# EAGLE design STM_Proto1 (EAGLE 6.1)
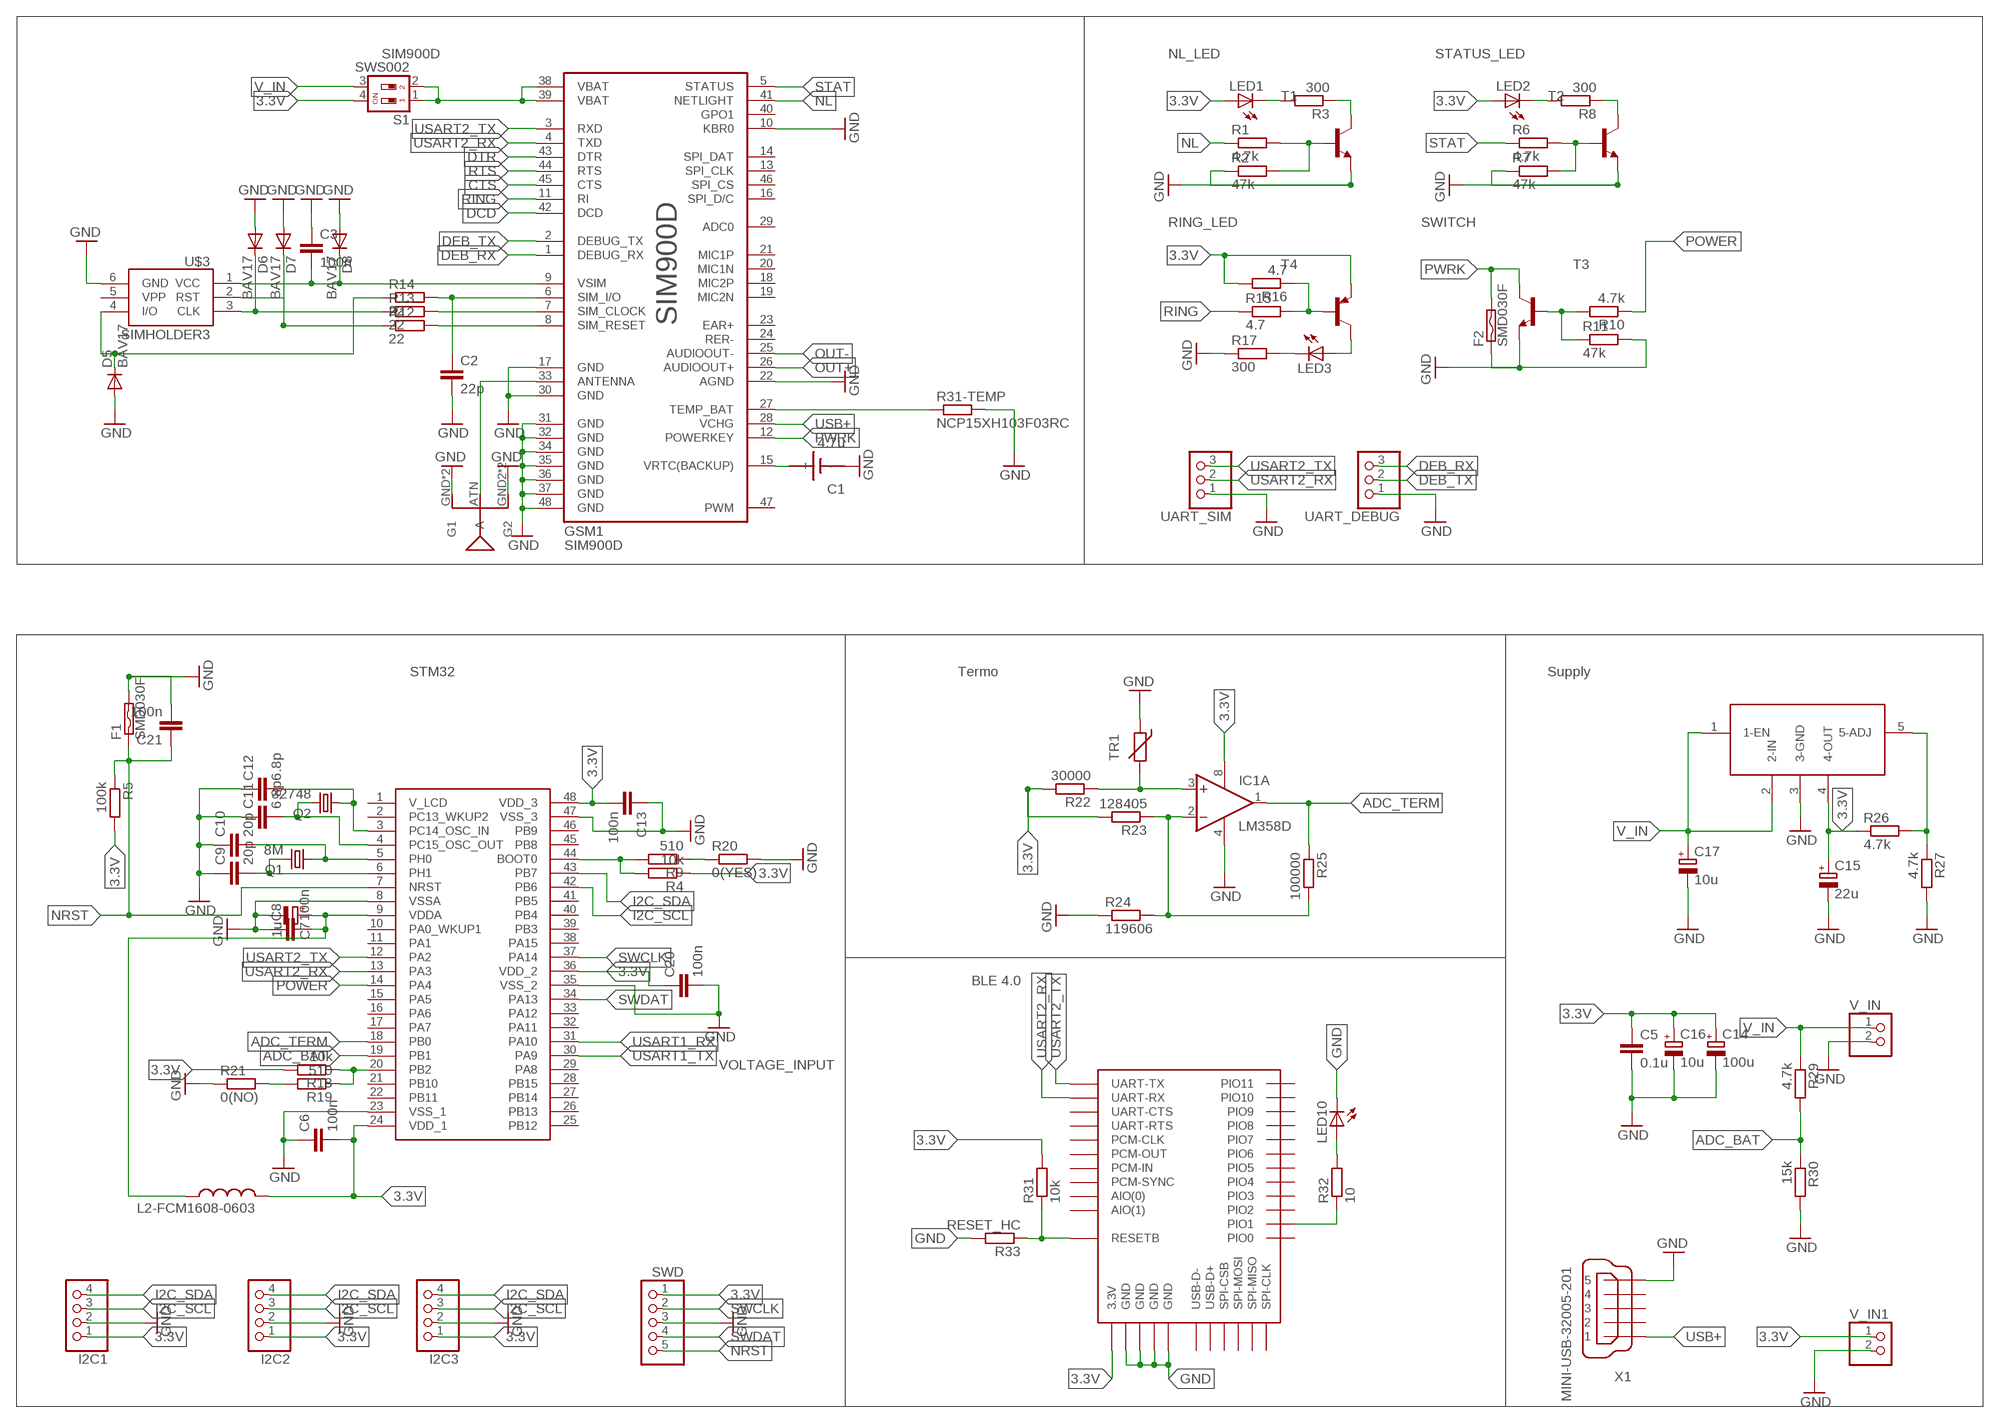
[diagram p0: schematic, sheet 1]

## Parts
C1  4.7u  SN2032  [SN2032]
C2  22p  C-EUC1206  [C1206]
C3  100n  C-EUC0805  [C0805]
C5  0.1u  C-EUC0805  [C0805]
C6  100n  C-EUC0805  [C0805]
C7  1u  CPOL-EU153CLV-0405  [153CLV-0405]
C8  100n  C-EUC0805  [C0805]
C9  20p  C-EUC0805  [C0805]
C10  20p  C-EUC0805  [C0805]
C11  6.8p  C-EUC0805  [C0805]
C12  6.8p  C-EUC0805  [C0805]
C13  100n  C-EUC0805  [C0805]
C14  100u  CPOL-EU153CLV-0807  [153CLV-0807]
C15  22u  CPOL-EU153CLV-0605  [153CLV-0605]
C16  10u  CPOL-EU153CLV-0505  [153CLV-0505]
C17  10u  CPOL-EU153CLV-0505  [153CLV-0505]
C20  100n  C-EUC0805  [C0805]
C21  100n  C-EUC0805  [C0805]
D5  BAV17  [DO35-10]
D6  BAV17  [DO35-10]
D7  BAV17  [DO35-10]
D8  BAV17  [DO35-10]
F1  SMD030F  [SMD050F]
F2  SMD030F  [SMD050F]
GSM1  SIM900D  [SIM900D]
I2C1  PINHD-1X4  [1X04]
I2C2  PINHD-1X4  [1X04]
I2C3  PINHD-1X4  [1X04]
IC1  LM358D  [SO08]
L2-FCM1608-0603  L-USL3216C  [L3216C]
LED1  LEDSMT1206  [1206]
LED2  LEDSMT1206  [1206]
LED3  LEDSMT1206  [1206]
LED10  LEDCHIPLED_1206  [CHIPLED_1206]
Q1  8M  CRYSTALHC49S  [HC49/S]
Q2  32748  CRYSTALTC26H  [TC26H]
R1  4.7k  R-EU_R0805  [R0805]
R2  47k  R-EU_R0805  [R0805]
R3  300  R-EU_R0805  [R0805]
R4  10k  R-EU_R0805  [R0805]
R5  100k  R-EU_R0805  [R0805]
R6  4.7k  R-EU_R0805  [R0805]
R7  47k  R-EU_R0805  [R0805]
R8  300  R-EU_R0805  [R0805]
R9  510  R-EU_R0805  [R0805]
R10  4.7k  R-EU_R0805  [R0805]
R11  47k  R-EU_R0805  [R0805]
R12  22  R-EU_R0805  [R0805]
R13  22  R-EU_R0805  [R0805]
R14  22  R-EU_R0805  [R0805]
R15  4.7  R-EU_R0805  [R0805]
R16  4.7  R-EU_R0805  [R0805]
R17  300  R-EU_R0805  [R0805]
R18  10k  R-EU_M0805  [M0805]
R19  510  R-EU_R0805  [R0805]
R20  0(YES)  R-EU_R1206  [R1206]
R21  0(NO)  R-EU_R1206  [R1206]
R22  30000  R-EU_R0805  [R0805]
R23  128405  R-EU_R0805  [R0805]
R24  119606  R-EU_R0805  [R0805]
R25  100000  R-EU_R0805  [R0805]
R26  4.7k  R-EU_R0805  [R0805]
R27  4.7k  R-EU_R0805  [R0805]
R29  4.7k  R-EU_R0805  [R0805]
R30  15k  R-EU_R0805  [R0805]
R31  10k  R-EU_M0805  [M0805]
R31-TEMP  NCP15XH103F03RC  R-EU_M0805  [M0805]
R32  10  R-EU_M0805  [M0805]
R33  RESET_HC  R-EU_M0805  [M0805]
S1  SWS002  [SMS-002]
STM32L152CBT6  STM32L152C6  [LQFP48]
SWD  PINHD-1X5  [1X05]
T1  BC846B-NPN-SOT23-BEC  [SOT23-BEC]
T2  BC846B-NPN-SOT23-BEC  [SOT23-BEC]
T3  BC846B-NPN-SOT23-BEC  [SOT23-BEC]
T4  BC858CLT1-PNP-SOT23-BEC  [SOT23-BEC]
TR1  THERMISTOR_R-7,5  [R-7,5]
U$2  GSM_ANT  [GSM]
U$3  SIMHOLDER3  [SIMHOLDER3]
U$4  BTM400_6B  [BTM400_6B]
U$5  MIC29302WT  [TO263-5]
UART_DEBUG  PINHD-1X3  [1X03]
UART_SIM  PINHD-1X3  [1X03]
V_IN  PINHD-1X2  [1X02]
V_IN1  PINHD-1X2  [1X02]
X1  MINI-USB-32005-201  [32005-201]

## Nets
3.3V: C5.1 C6.2 C13.2 C14.+ C15.+ C16.+ C20.1 I2C1.1 I2C2.1 I2C3.1 IC1.8(P:V+) L2-FCM1608-0603.2 LED1.A LED2.A R4.1 R5.2 R16.2 R18.2 R22.2 R23.2 R26.1 R31.2 S1.4 STM32L152CBT6.24(VDD_1) STM32L152CBT6.36(VDD_2) STM32L152CBT6.48(VDD_3) SWD.1 T4.E U$4.3.3V U$5.4(4-OUT) V_IN1.1
ADC_BAT: R29.2 R30.1 STM32L152CBT6.19(PB1)
ADC_TERM: IC1.1(A:OUT) R25.1 STM32L152CBT6.18(PB0)
CTS: GSM1.45(CTS)
DCD: GSM1.42(DCD)
DEB_RX: GSM1.1(DEBUG_RX) UART_DEBUG.3
DEB_TX: GSM1.2(DEBUG_TX) UART_DEBUG.2
DTR: GSM1.43(DTR)
GND: C1.- C2.2 C3.1 C5.2 C6.1 C7.- C8.1 C9.1 C10.1 C11.1 C12.1 C13.1 C14.- C15.- C16.- C17.- C20.2 C21.2 D5.A D6.A D7.A D8.A F1.2 F2.1 GSM1.10(KBR0) GSM1.17(GND) GSM1.22(AGND) GSM1.30(GND) GSM1.31(GND) GSM1.32(GND) GSM1.34(GND) GSM1.35(GND) GSM1.36(GND) GSM1.37(GND) GSM1.48(GND) I2C1.2 I2C2.2 I2C3.2 IC1.4(P:V-) LED10.C R2.1 R7.1 R11.2 R17.1 R20.2 R21.1 R24.1 R27.2 R30.2 R31-TEMP.2 R33.2 STM32L152CBT6.8(VSSA) STM32L152CBT6.23(VSS_1) STM32L152CBT6.35(VSS_2) STM32L152CBT6.47(VSS_3) SWD.3 T1.E T2.E T3.E TR1.1 U$2.GND1(G1) U$2.GND2(G2) U$2.GND3(G2) U$2.GND(G1) U$3.6(GND) U$4.GND@1(GND) U$4.GND@2(GND) U$4.GND@3(GND) U$4.GND@4(GND) U$5.3(3-GND) UART_DEBUG.1 UART_SIM.1 V_IN1.2 V_IN.2 X1.5
I2C_SCL: I2C1.3 I2C2.3 I2C3.3 STM32L152CBT6.42(PB6)
I2C_SDA: I2C1.4 I2C2.4 I2C3.4 STM32L152CBT6.43(PB7)
N$1: R10.2 R11.1 T3.B
N$2: C10.2 Q1.1 STM32L152CBT6.5(PH0)
N$3: LED1.C R3.2
N$4: R1.2 R2.2 T1.B
N$5: R3.1 T1.C
N$6: R31.1 R33.1 U$4.RESETB
N$8: R6.2 R7.2 T2.B
N$9: R8.1 T2.C
N$10: C3.2 D8.C GSM1.9(VSIM) U$3.1(VCC)
N$11: LED2.C R8.2
N$12: IC1.2(A:-IN) R23.1 R24.2 R25.2
N$13: IC1.3(A:+IN) R22.1 TR1.2
N$14: D7.C R12.1 U$3.2(RST)
N$15: GSM1.8(SIM_RESET) R12.2
N$16: D6.C R13.1 U$3.3(CLK)
N$17: GSM1.7(SIM_CLOCK) R13.2
N$18: D5.C R14.1 U$3.4(I/O)
N$19: C2.1 GSM1.6(SIM_I/O) R14.2
N$20: GSM1.27(TEMP_BAT) R31-TEMP.1
N$21: R32.1 U$4.PIO(1)(PIO1)
N$22: R15.2 R16.1 T4.B
N$23: GSM1.33(ANTENNA) U$2.ATN(A)
N$24: LED3.A T4.C
N$25: LED3.C R17.2
N$28: C9.2 Q1.2 STM32L152CBT6.6(PH1)
N$29: C11.2 Q2.2 STM32L152CBT6.4(PC15_OSC_OUT)
N$30: C12.2 Q2.1 STM32L152CBT6.3(PC14_OSC_IN)
N$31: C7.+ C8.2 L2-FCM1608-0603.1 STM32L152CBT6.9(VDDA)
N$32: R4.2 R9.2 STM32L152CBT6.44(BOOT0)
N$33: LED10.A R32.2
N$34: R9.1 R20.1
N$35: R18.1 R19.1 STM32L152CBT6.20(PB2)
N$36: R19.2 R21.2
N$38: R26.2 R27.1 U$5.5(5-ADJ)
NL: GSM1.41(NETLIGHT) R1.1
NRST: C21.1 F1.1 R5.1 STM32L152CBT6.7(NRST) SWD.5
OUT+: GSM1.26(AUDIOOUT+)
OUT-: GSM1.25(AUDIOOUT-)
POWER: R10.1 STM32L152CBT6.14(PA4)
PWRK: F2.2 GSM1.12(POWERKEY) T3.C
RING: GSM1.11(RI) R15.1
RTS: GSM1.44(RTS)
STAT: GSM1.5(STATUS) R6.1
SWCLK: STM32L152CBT6.37(PA14) SWD.2
SWDAT: STM32L152CBT6.34(PA13) SWD.4
USART1_RX: STM32L152CBT6.31(PA10)
USART1_TX: STM32L152CBT6.30(PA9)
USART2_RX: GSM1.4(TXD) STM32L152CBT6.13(PA3) U$4.UART-RX UART_SIM.2
USART2_TX: GSM1.3(RXD) STM32L152CBT6.12(PA2) U$4.UART-TX UART_SIM.3
USB+: GSM1.28(VCHG) X1.1
V_IN: C17.+ R29.1 S1.3 U$5.1(1-EN) U$5.2(2-IN) V_IN.1
VBAT@2: GSM1.38(VBAT) GSM1.39(VBAT) S1.1 S1.2
VRTC(BACKUP): C1.+ GSM1.15(VRTC(BACKUP))
Unconnected: GSM1.13(SPI_CLK) GSM1.14(SPI_DAT) GSM1.16(SPI_D/C) GSM1.18(MIC2P) GSM1.19(MIC2N) GSM1.20(MIC1N) GSM1.21(MIC1P) GSM1.23(EAR+) GSM1.24(RER-) GSM1.29(ADC0) GSM1.40(GPO1) GSM1.46(SPI_CS) GSM1.47(PWM) IC1.5(B:+IN) IC1.6(B:-IN) IC1.7(B:OUT) STM32L152CBT6.1(V_LCD) STM32L152CBT6.2(PC13_WKUP2) STM32L152CBT6.10(PA0_WKUP1) STM32L152CBT6.11(PA1) STM32L152CBT6.15(PA5) STM32L152CBT6.16(PA6) STM32L152CBT6.17(PA7) STM32L152CBT6.21(PB10) STM32L152CBT6.22(PB11) STM32L152CBT6.25(PB12) STM32L152CBT6.26(PB13) STM32L152CBT6.27(PB14) STM32L152CBT6.28(PB15) STM32L152CBT6.29(PA8) STM32L152CBT6.32(PA11) STM32L152CBT6.33(PA12) STM32L152CBT6.38(PA15) STM32L152CBT6.39(PB3) STM32L152CBT6.40(PB4) STM32L152CBT6.41(PB5) STM32L152CBT6.45(PB8) STM32L152CBT6.46(PB9) U$3.5(VPP) U$4.AIO(0) U$4.AIO(1) U$4.PCM-CLK U$4.PCM-IN U$4.PCM-OUT U$4.PCM-SYNC U$4.PIO(0)(PIO0) U$4.PIO(2)(PIO2) U$4.PIO(3)(PIO3) U$4.PIO(4)(PIO4) U$4.PIO(5)(PIO5) U$4.PIO(6)(PIO6) U$4.PIO(7)(PIO7) U$4.PIO(8)(PIO8) U$4.PIO(9)(PIO9) U$4.PIO(10)(PIO10) U$4.PIO(11)(PIO11) U$4.SPI-CLK U$4.SPI-CSB U$4.SPI-MISO U$4.SPI-MOSI U$4.UART-CTS U$4.UART-RTS U$4.USB-D+ U$4.USB-D- X1.2 X1.3 X1.4

## Notes on the sheet
- SIM900D | NL_LED | STATUS_LED
- RING_LED | SWITCH
- STM32 | Termo | Supply
- BLE 4.0
- VOLTAGE_INPUT

## Library data of the parts
C1 = sn2032:SN2032: LI BATTERY
C2 C3 C5 C6 C8-C13 C20 C21 = resistor:C-EU: CAPACITOR, European symbol
C7 C14-C17 = resistor:CPOL-EU: POLARIZED CAPACITOR, European symbol
D5-D8 = diode:BAV17: DIODE silicon-epitaxial planar diode
F1 F2 = switch-raychem:SMD*F: PolySwitch (TM) Resettable Device Source: Data sheet <http://www.farnell.com/datasheets/13482.pdf>
GSM1 = SIM900D:SIM900D: maciek@chwarzno.pl Maciej Kalinowski SIM900D MARITEX: SIM900D http://wm.sim.com/upfile/201264161119f.pdf
I2C1-I2C3 = pinhead:PINHD-1X4: PIN HEADER
IC1 = linear:LM358: OP AMP also LM158; LM258; LM2904 Source: http://cache.national.com/ds/LM/LM158.pdf
L2-FCM1608-0603 = resistor:L-US: INDUCTOR, American symbol
LED1-LED3 LED10 = led:LED: LED OSRAM: - CHIPLED LG R971, LG N971, LY N971, LG Q971, LY Q971, LO R971, LY R971 LH N974, LH R974 LS Q976, LO Q976, LY Q976 LO Q996 - Hyper CHIPLED LW Q18S LB Q993, LB Q99A, LB R99A - SideLED LS A670, LO A670, LY A670, LG A670, LP A670 LB A673, LV A673, LT A673, LW A673 LH A674 LY A675 LS A676, LA A676, LO A676, LY A676, LW A676 LS A679, LY A679, LG A679 - Hyper Micro SIDELED® LS Y876, LA Y876, LO Y876, LY Y876 LT Y87S - SmartLED LW L88C, LW L88S LB L89C, LB L89S, LG L890 LS L89K, LO L89K, LY L89K LS L896, LA L896, LO L896, LY L896 - TOPLED LS T670, LO T670, LY T670, LG T670, LP T670 LSG T670, LSP T670, LSY T670, LOP T670, LYG T670 LG T671, LOG T671, LSG T671 LB T673, LV T673, LT T673, LW T673 LH T674 LS T676, LA T676, LO T676, LY T676, LB T676, LH T676, LSB T676, LW T676 LB T67C, LV T67C, LT T67C, LS T67K, LO T67K, LY T67K, LW E67C LS E67B, LA E67B, LO E67B, LY E67B, LB E67C, LV E67C, LT E67C LW T67C LS T679, LY T679, LG T679 LS T770, LO T770, LY T770, LG T770, LP T770 LB T773, LV T773, LT T773, LW T773 LH T774 LS E675, LA E675, LY E675, LS T675 LS T776, LA T776, LO T776, LY T776, LB T776 LHGB T686 LT T68C, LB T68C - Hyper Mini TOPLED® LB M676 - Mini TOPLED Santana® LG M470 LS M47K, LO M47K, LY M47K Source: http://www.osram.convergy.de LUXEON: - LUMILED® LXK2-PW12-R00, LXK2-PW12-S00, LXK2-PW14-U00, LXK2-PW14-V00 LXK2-PM12-R00, LXK2-PM12-S00, LXK2-PM14-U00 LXK2-PE12-Q00, LXK2-PE12-R00, LXK2-PE12-S00, LXK2-PE14-T00, LXK2-PE14-U00 LXK2-PB12-K00, LXK2-PB12-L00, LXK2-PB12-M00, LXK2-PB14-N00, LXK2-PB14-P00, LXK2-PB14-Q00 LXK2-PR12-L00, LXK2-PR12-M00, LXK2-PR14-Q00, LXK2-PR14-R00 LXK2-PD12-Q00, LXK2-PD12-R00, LXK2-PD12-S00 LXK2-PH12-R00, LXK2-PH12-S00 LXK2-PL12-P00, LXK2-PL12-Q00, LXK2-PL12-R00 Source: www.luxeon.com KINGBRIGHT: KA-3528ASYC Source: www.kingbright.com
Q1 = crystal:CRYSTAL: CRYSTAL; OC_FARNELL: 1667008; OC_NEWARK: unknown
Q2 = crystal:CRYSTAL: CRYSTAL; OC_FARNELL: unknown; OC_NEWARK: unknown
R1-R27 R29-R31 R31-TEMP R32 R33 = resistor:R-EU_: RESISTOR, European symbol
S1 = smd-special:SWS002: SMD Dip Switch 2 pol.
STM32L152CBT6 = STM32L152:STM32L152C6
SWD = pinhead:PINHD-1X5: PIN HEADER
T1-T3 = transistor:*-NPN-: NPN Transistror BF959 corrected 2008.03.06
T4 = transistor:*-PNP-: PNP Transistror
TR1 = discrete:THERMISTOR_: Thermo Resistor
U$2 = discrete:GSM_ANT
U$3 = SparkFun-Connectors:SIMHOLDER3: Alternate SIM card socket
U$4 = hc-05 eagle lib:BTM400_6B
U$5 = MIC29302WT:MIC29302WT
UART_DEBUG UART_SIM = pinhead:PINHD-1X3: PIN HEADER
V_IN V_IN1 = pinhead:PINHD-1X2: PIN HEADER
X1 = con-cypressindustries:MINI-USB-: MINI USB-B Conector Source: www.cypressindustries.com; OC_FARNELL: unknown; OC_NEWARK: unknown

## Board
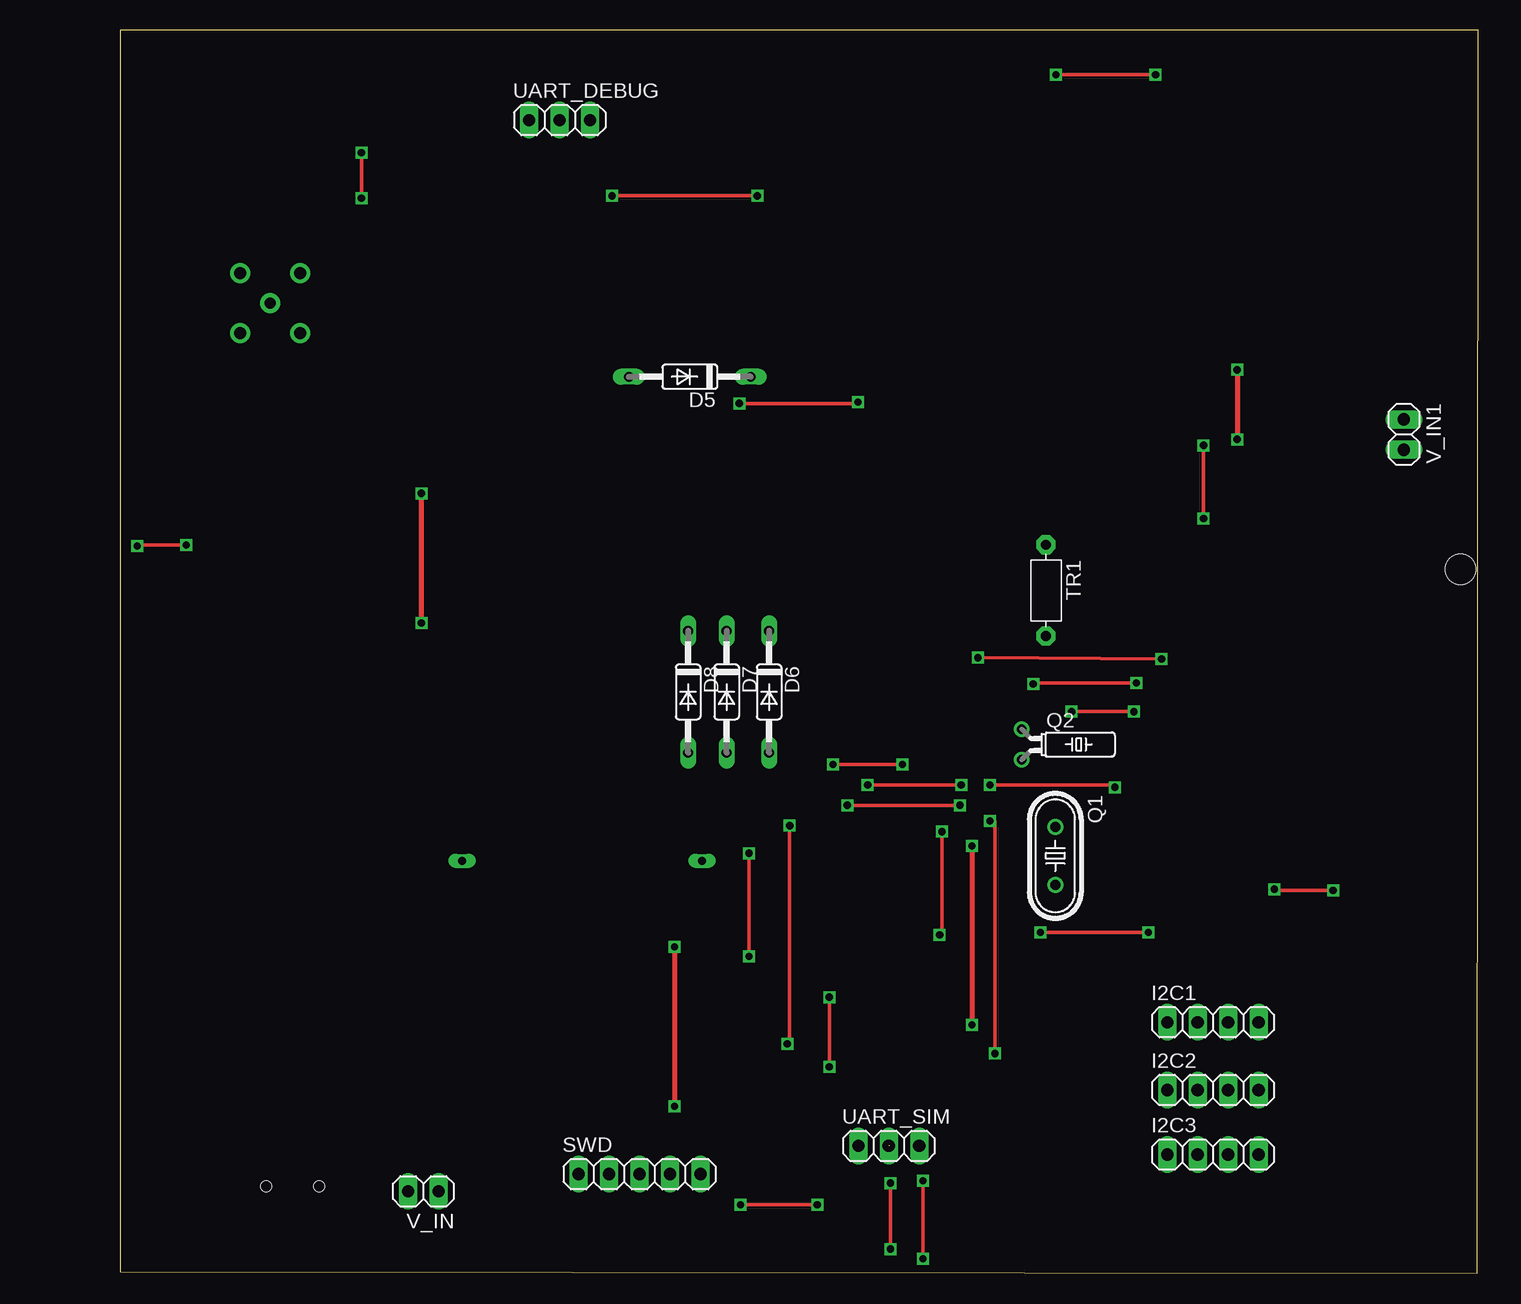
[diagram p1: board, top side]
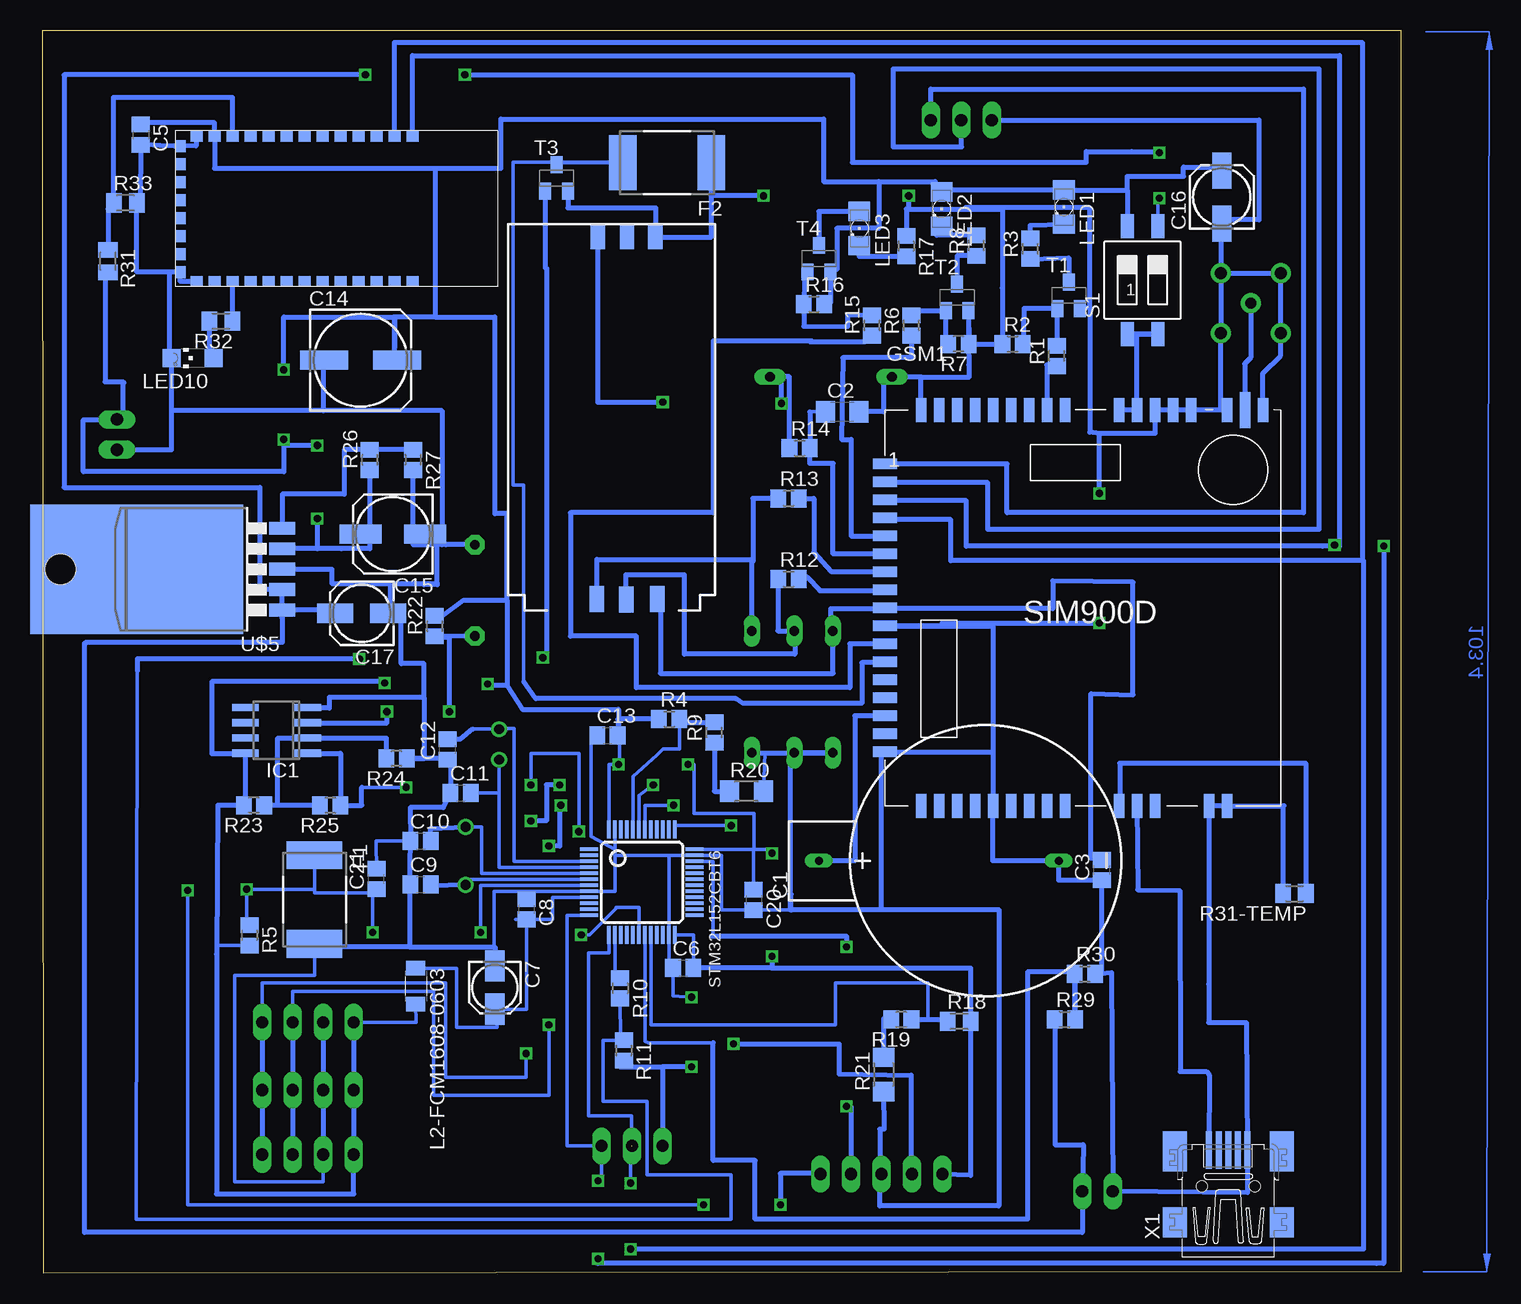
[diagram p2: board, bottom side, seen from below]

Size 113.2 x 103.6 mm. Coordinates in mm from the lower left corner, seen from the top.
Outline: 0,0.1 113.1,0 113.2,103.6 0,103.6 0,0.1
Copper layers (1*16): Top 0.035mm / dielectric 1.5mm / Bottom 0.035mm
Design rules: minimum track width 10mil, minimum drill 24mil, track to track 8mil, track to pad 8mil, pad to pad 8mil, via to via 8mil, smd to smd 8mil, copper to edge 40mil, drill to drill 8mil, minimum pad ring 10mil, minimum via ring 8mil, stop-mask expansion 4mil, vias tented up to drill 0mil, thermal gap 10mil

### Footprints (pad centres in the part's own frame; a part is rotated, then mirrored left to right if it is on the bottom)
SN2032 = drill 0.65 long: + 0,13.9; - 0,-6.1
C1206 = smd 1.6 x 1.8: 1 -1.4,0; 2 1.4,0
C0805 = smd 1.3 x 1.5: 1 -0.85,0; 2 0.85,0
153CLV-0405 = smd 2.6 x 1.6: + 1.8,0; - -1.8,0
153CLV-0807 = smd 4 x 1.6: + 3.05,0; - -3.05,0
153CLV-0605 = smd 3.5 x 1.6: + 2.7,0; - -2.7,0
153CLV-0505 = smd 3 x 1.6: + 2.2,0; - -2.2,0
DO35-10 = drill 0.813 long: A 5.08,0; C -5.08,0
SMD050F = smd 2.3 x 4.6: 1 -3.7,0; 2 3.7,0
SIM900D = smd 2 x 0.9: 1 0,28.5; 2 0,27; 3 0,25.5; 4 0,24; 5 0,22.5; 6 0,21; 7 0,19.5; 8 0,18; 9 0,16.5; 10 0,15; 11 0,13.5; 12 0,12; 13 0,10.5; 14 0,9; 15 0,7.5; 16 0,6; 17 0,4.5 | smd 0.9 x 2: 18 3,0; 19 4.5,0; 20 6,0; 21 7.5,0; 22 9,0; 23 10.5,0; 24 12,0; 25 13.5,0; 26 15,0; 27 19.5,0; 28 21,0; 29 22.5,0; 30 27,0; 31 28.5,0; 32 31.5,33; 34 28.5,33; 35 25.5,33; 36 24,33; 37 22.5,33; 38 21,33; 39 19.5,33; 40 15,33; 41 13.5,33; 42 12,33; 43 10.5,33; 44 9,33; 45 7.5,33; 46 6,33; 47 4.5,33; 48 3,33 | smd 0.9 x 3: 33 30,33
1X04 = drill 1.016 long: 1 -3.81,0; 2 -1.27,0; 3 1.27,0; 4 3.81,0
SO08 = smd 0.6 x 2.2: 1 -1.905,-2.6; 2 -0.635,-2.6; 3 0.635,-2.6; 4 1.905,-2.6; 5 1.905,2.6; 6 0.635,2.6; 7 -0.635,2.6; 8 -1.905,2.6
L3216C = smd 1.2 x 1.6: 1 -1.5,0; 2 1.5,0
1206 = smd 1.6 x 1.803: A -1.422,0; C 1.422,0
CHIPLED_1206 = smd 1.5 x 1.5: A 0,-1.75; C 0,1.75
HC49/S = drill 0.813: 1 -2.413,0; 2 2.413,0
TC26H = drill 0.813: 1 -1.27,0; 2 1.27,0
R0805 = smd 1.3 x 1.5: 1 -0.85,0; 2 0.85,0
M0805 = smd 1.3 x 1.6: 1 -0.95,0; 2 0.95,0
R1206 = smd 1.6 x 1.803: 1 -1.422,0; 2 1.422,0
SMS-002 = smd 1.092 x 2.007: 1 -1.27,-4.496; 2 1.27,-4.496; 3 1.27,4.496; 4 -1.27,4.496
LQFP48 = smd 0.3 x 1.5: 1 -2.75,-4.4; 2 -2.25,-4.4; 3 -1.75,-4.4; 4 -1.25,-4.4; 5 -0.75,-4.4; 6 -0.25,-4.4; 7 0.25,-4.4; 8 0.75,-4.4; 9 1.25,-4.4; 10 1.75,-4.4; 11 2.25,-4.4; 12 2.75,-4.4; 25 2.75,4.4; 26 2.25,4.4; 27 1.75,4.4; 28 1.25,4.4; 29 0.75,4.4; 30 0.25,4.4; 31 -0.25,4.4; 32 -0.75,4.4; 33 -1.25,4.4; 34 -1.75,4.4; 35 -2.25,4.4; 36 -2.75,4.4 | smd 1.5 x 0.3: 13 4.4,-2.75; 14 4.4,-2.25; 15 4.4,-1.75; 16 4.4,-1.25; 17 4.4,-0.75; 18 4.4,-0.25; 19 4.4,0.25; 20 4.4,0.75; 21 4.4,1.25; 22 4.4,1.75; 23 4.4,2.25; 24 4.4,2.75; 37 -4.4,2.75; 38 -4.4,2.25; 39 -4.4,1.75; 40 -4.4,1.25; 41 -4.4,0.75; 42 -4.4,0.25; 43 -4.4,-0.25; 44 -4.4,-0.75; 45 -4.4,-1.25; 46 -4.4,-1.75; 47 -4.4,-2.25; 48 -4.4,-2.75
1X05 = drill 1.016 long: 1 -5.08,0; 2 -2.54,0; 3 0,0; 4 2.54,0; 5 5.08,0
SOT23-BEC = smd 1 x 1.4: B -0.95,-1.1; C 0,1.1; E 0.95,-1.1
R-7,5 = drill 0.813 pad 1.6 octagon: 1 -3.81,0; 2 3.81,0
GSM = drill 0.9 pad 1.676: ATN 0,0 | drill 1 pad 1.676: GND -2.5,2.5; GND1 -2.5,-2.5; GND2 2.5,-2.5; GND3 2.5,2.5
SIMHOLDER3 = smd 2.2 x 1.2: 1 0.95,4.81; 2 0.91,7.41; 3 0.95,9.86 | smd 2 x 1.2: 4 31.1,9.78; 5 31.12,7.34; 6 31.12,4.98
BTM400_6B = smd 0.9 x 1: 3.3V -6.05,-10.16; AIO(0) -6.05,-5.66; AIO(1) -6.05,-7.16; GND@1 -6.05,-11.66; GND@4 6.05,-11.66; PCM-CLK -6.05,0.34; PCM-IN -6.05,-2.66; PCM-OUT -6.05,-1.16; PCM-SYNC -6.05,-4.16; PIO(0) 6.05,-10.16; PIO(1) 6.05,-8.66; PIO(2) 6.05,-7.16; PIO(3) 6.05,-5.66; PIO(4) 6.05,-4.16; PIO(5) 6.05,-2.66; PIO(6) 6.05,-1.16; PIO(7) 6.05,0.34; PIO(8) 6.05,1.84; PIO(9) 6.05,3.34; PIO(10) 6.05,4.84; PIO(11) 6.05,6.34; RESETB -6.05,-8.66; UART-CTS -6.05,3.34; UART-RTS -6.05,1.84; UART-RX -6.05,4.84; UART-TX -6.05,6.34 | smd 1 x 0.9: GND@2 -5.23,-13; GND@3 5.27,-13; SPI-CLK 2.27,-13; SPI-CSB -2.23,-13; SPI-MISO 0.77,-13; SPI-MOSI -0.73,-13; USB-D+ 3.77,-13; USB-D- -3.73,-13
TO263-5 = smd 1.067 x 2.159: 1 -3.404,-8.331; 2 -1.702,-8.331; 3 0,-8.331; 4 1.702,-8.331; 5 3.404,-8.331 | smd 10.8 x 17.78: 6-GND 0,3.81 | hole 2.54: 0,10.16
1X03 = drill 1.016 long: 1 -2.54,0; 2 0,0; 3 2.54,0
1X02 = drill 1.016 long: 1 -1.27,0; 2 1.27,0
32005-201 = smd 3.1 x 0.5: 1 3,1.6; 2 3,0.8; 3 3,0; 4 3,-0.8; 5 3,-1.6 | smd 2.5 x 2: M1 -3,-4.45; M2 -3,4.45 | smd 3.3 x 2: M3 2.9,4.45; M4 2.9,-4.45 | hole 0.9: 0,2.2; 0,-2.2

### Placement (x,y rotation side)
C1  34.59,34.37 90 bottom
C2  46.54,71.81 0 bottom
C3  24.9,33.59 90 bottom
C5  105.02,94.89 270 bottom
C6  59.8,25.43 0 bottom
C7  75.5,23.8 270 bottom
C8  72.87,30.33 270 bottom
C9  81.69,32.41 0 bottom
C10  81.69,36.02 0 bottom
C11  78.35,40.03 0 bottom
C12  79.44,43.65 90 bottom
C13  66.12,44.83 0 bottom
C14  86.7,76.1 0 bottom
C15  84,61.6 180 bottom
C16  14.9,89.7 90 bottom
C17  86.6,55 180 bottom
C20  53.92,31.11 270 bottom
C21  85.37,32.85 90 bottom
D5  47.48,74.72 180 top
D6  54.08,48.45 270 top
D7  50.54,48.45 270 top
D8  47.33,48.45 270 top
F1  90.54,31.14 270 bottom
F2  61.15,92.56 180 bottom
GSM1  42.96,38.96 0 bottom
I2C1  91.08,20.91 0 top
I2C2  91.08,15.26 0 top
I2C3  91.08,9.88 0 top
IC1  93.7,45.24 90 bottom
L2-FCM1608-0603  82.1,23.92 270 bottom
LED1  28.06,88.87 270 bottom
LED2  38.26,88.71 270 bottom
LED3  45.11,87.08 270 bottom
LED10  100.69,76.28 90 bottom
Q1  77.94,34.78 270 top
Q2  75.14,44.07 270 top
R1  28.66,76.46 90 bottom
R2  32.34,77.44 0 bottom
R3  30.86,85.39 90 bottom
R4  60.97,46.18 0 bottom
R5  95.95,28.15 270 bottom
R6  40.77,79 90 bottom
R7  36.86,77.46 180 bottom
R8  35.36,85.66 90 bottom
R9  57.2,45.07 90 bottom
R10  65.05,23.75 270 bottom
R11  64.75,18.56 270 bottom
R12  51.01,57.84 0 bottom
R13  51.01,64.58 0 bottom
R14  50.09,68.76 0 bottom
R15  44.07,79 90 bottom
R16  48.89,80.76 0 bottom
R17  41.2,85.61 270 bottom
R18  36.8,20.99 0 bottom
R19  41.62,21.14 180 bottom
R20  54.52,40.17 0 bottom
R21  43.09,16.56 90 bottom
R22  80.51,53.93 90 bottom
R23  95.58,39 180 bottom
R24  83.7,42.89 180 bottom
R25  89.22,38.99 180 bottom
R26  85.92,67.79 90 bottom
R27  82.31,67.79 270 bottom
R29  27.99,21.15 0 bottom
R30  26.31,24.95 0 bottom
R31  107.75,84.36 270 bottom
R31-TEMP  8.85,31.64 180 bottom
R32  98.34,79.36 180 bottom
R33  106.3,89.22 0 bottom
S1  21.51,82.77 0 bottom
STM32L152CBT6  63.24,32.58 270 bottom
SWD  43.28,8.25 0 top
T1  27.66,81.51 0 bottom
T2  36.96,81.34 0 bottom
T3  70.35,91.29 0 bottom
T4  48.49,84.57 0 bottom
TR1  77.16,56.91 270 top
U$2  12.48,80.87 180 top
U$3  57.14,55.24 90 bottom
U$4  88.71,88.72 270 bottom
U$5  101.55,58.68 90 bottom
UART_DEBUG  36.62,96.12 0 top
UART_SIM  64.06,10.6 0 top
V_IN  25.27,6.81 180 top
V_IN1  107,69.9 270 top
X1  14.36,7.25 90 bottom

### Tracks (layer width: path | path; a pad name or v marks a point on that pad's centre or on a via)
3.3V  (via drill 0.6)
  Top 0.305: v90.3,69 v90.3,62.9 | v59.4,42.4 v65.2,42.4 | v84.7,49.2 76.1,49.2 v76.1,49.1 | v52.4,35 v52.4,26.4
  Top 0.406: v93.1,75.3 v93.1,69.5
  Bottom 0.305: C13.2 65.1,45.83 65.1,42.5 v65.2,42.4 65.99,42.4 STM32L152CBT6.48 | C20.1 53.92,35.3 | 53.92,35.3 53.92,35.33 STM32L152CBT6.36 53.9,35.33 53.9,38.3 58.9,38.3 58.9,42.4 v59.4,42.4 | R5.2 98.7,27.3 98.7,26.6 | L2-FCM1608-0603.2 82.08,20.91 I2C1.1 | 84.7,49.3 v84.7,49.2 | V_IN1.1 106.8,71.17 | 58.5,25.43 C6.2 58.95,28.18 STM32L152CBT6.24 | v52.4,35 52.5,35.33 52.5,35.3 53.92,35.3 | v52.4,26.4 52.41,26.5
  Bottom 0.406: 22.78,90.29 S1.4 | 22.78,90.29 LED1.A 38.26,90.29 LED2.A 38.8,90.13 38.8,91 43.5,91 | 22.78,90.29 22.78,91.44 18.1,91.44 18.1,92.2 14.9,92.2 C16.+ 14.9,91.8 | R16.2 47.54,80.87 T4.E 47,83.67 47,87.1 43.5,87.1 43.5,91 | R4.1 65.2,46.18 | R22.2 79.9,54.78 78.1,56.1 74.5,56.1 | 74.5,56.1 74.5,49 | 88.3,60.38 85.92,60.38 85.92,61.5 | 88.3,60.38 U$5.4 | 43.5,91 48.1,91 48.1,96.2 75,96.2 75,92.1 80.5,92.1 | C5.1 105,95.64 105,95.9 98.87,95.9 U$4.3.3V 98.87,92.1 80.5,92.1 | I2C1.1 I2C2.1 I2C3.1 87.27,6.6 98.7,6.6 98.7,26.6 98.6,39 R23.2 96.3,39 IC1.8 96.3,43.3 99.1,43.3 99.1,49.3 84.7,49.3 | 74.5,56.1 74.5,63.3 75.5,63.3 75.5,79.7 80.5,79.7 | 106.5,74.31 106.4,74.21 | 80.5,92.1 80.5,79.7 | 80.5,79.7 83.87,79.7 83.87,77.1 83.9,76.4 | v93.1,75.3 93.1,79.7 83.9,79.7 83.9,76.4 | R31.2 108,83.16 108,74.31 106.5,74.31 | 106.5,74.31 106.5,71.3 106.9,71.27 106.8,71.17 | v90.3,69 93.1,69 | 93.1,69 93.1,66.8 109.8,66.8 109.8,71.11 108,71.11 108,71.17 V_IN1.1 | v90.3,62.9 90.3,60.4 88.3,60.4 88.3,60.38 | R26.1 85.92,61.5 | v93.1,69.5 93.1,69 | 74.5,49 76.1,49 v76.1,49.1 | C13.2 65.23,44.83 65.23,46.18 65.2,46.18 | 74.5,49 73.2,47 65.2,47 65.2,46.18 | 52.41,26.5 52.41,25.43 | 52.41,25.43 C6.2 | SWD.1 35.85,8.15 R18.2 35.85,25.43 52.41,25.43 | C15.+ 85.92,61.5 | 83.9,76.4 83.9,76.1 C14.+
ADC_BAT
  Bottom 0.305: STM32L152CBT6.19 63,19.3 62.7,19.2 57.3,19.2
  Bottom 0.406: R30.1 27.14,24.95 R29.2 27.14,25.1 31.1,25.1 31.1,4.5 53.8,4.5 53.8,9.4 57.3,9.4 57.3,19.2
ADC_TERM  (via drill 0.6)
  Top 0.305: v68.3,28.2 68.5,28.2 v68.5,36.8 | v72.5,40.7 82.9,40.7 v82.9,40.5
  Bottom 0.305: STM32L152CBT6.18 63.49,30.5 65.4,30.5 65.4,30.4 67.6,28.2 v68.3,28.2 | v68.5,36.8 68.5,43.3 72.5,43.3 v72.5,40.7 | v82.9,40.5 86.6,40.5
  Bottom 0.406: 86.6,40.5 86.6,38.99 R25.1 88.37,43.34 IC1.1
DEB_RX
  Bottom 0.305: 42.9,67.5 42.9,67.4 42.96,67.4 GSM1.1
  Bottom 0.406: UART_DEBUG.3 39.16,98.7 8.1,98.7 8.1,63.4 32.8,63.4 32.8,67.46 GSM1.1
DEB_TX
  Bottom 0.305: UART_DEBUG.2 36.6,95.62
  Bottom 0.406: GSM1.2 42.9,65.96 42.9,65.9 34.4,65.9 34.4,62 6.8,62 6.8,100.4 42.3,100.4 42.3,93.9 36.6,93.9 36.6,95.62
GND  (via drill 0.6)
  Top 0.305: v59.1,23 v59.1,17.2 | v41,89.8 v53.1,89.8
  Top 0.406: v25.1,54.2 v25.1,65
  Bottom 0.305: 61,34.83 STM32L152CBT6.35 56.6,34.83 56.6,30.26 C20.2 50.8,30.26 | 61,34.83 65.49,34.83 | 65.49,34.83 65.49,35.3 | 65.49,35.3 STM32L152CBT6.47 | 61,34.83 STM32L152CBT6.23 61,25.4 60.65,25.4 C6.1 60.65,23.1 v59.1,23 | 65.49,34.83 65.49,31.83 STM32L152CBT6.8 75.57,31.83 | 75.57,31.83 72.9,31.8 72.9,31.18 C8.1 | 82.56,33.99 82.6,33.99 | 75.57,31.83 75.57,27.29 75.82,27.19 | 89.6,22 89.81,22 I2C1.2 | 90.4,27.44 F1.2 90.54,24.8 97.2,24.8 97.2,7.6 89.8,7.6 I2C3.2 | 65.53,34.83 65.49,34.83 | C10.1 85.4,36.02 85.4,35.8 C21.2 | C13.1 67.5,44.93 67.5,36.4 65.49,35.3 | 50.8,43.37 D7.A | R20.2 53,43.4 54.1,43.37 | D6.A 54.1,43.37 | 54.1,43.37 54.1,43.4 | 40.94,89.8 v41,89.8
  Bottom 0.406: GSM1.34 14.98,71.96 | 14.98,71.96 U$2.GND U$2.GND1 | U$2.GND1 U$2.GND2 U$2.GND3 10,78.35 10,76.5 11.46,75.04 GSM1.32 | 14.98,71.96 GSM1.35 GSM1.36 GSM1.37 20.46,70 25.1,70 | 25.1,70 25.9,70.1 25.9,80.51 | 14.98,87.8 U$2.GND1 | UART_DEBUG.1 11.8,96.12 11.8,87.8 14.9,87.8 | 39.96,74.66 36,74.66 36,75.7 R7.1 T2.E 35.99,77.44 R2.1 33.2,82.14 33.2,88.7 | 41,88.7 33.2,88.7 | T1.E 25.9,80.51 | 25.9,80.51 25.9,88.8 36.3,88.8 33.2,88.7 | 9.8,38.96 GSM1.31 GSM1.30 16,24.1 16,20.9 12.86,20.9 X1.5 12.76,6.7 V_IN.2 | V_IN.2 | 33.96,43.46 GSM1.17 43.3,43.46 43.3,30.3 | 33.96,43.46 GSM1.22 33.96,39 34,39 34,34.37 C1.- 28.49,32.74 C3.1 24.9,24.95 R30.2 24.1,25.05 V_IN.2 | 77.06,60.68 TR1.1 79.9,60.72 | D6.A D7.A D8.A 50.9,43.37 50.9,31.6 | U$4.GND@1 100.41,93.97 U$4.GND@2 102.2,93.95 103.4,94 105.32,94.1 C5.2 105.05,89.24 R33.2 105.35,83.45 102.6,83.45 | I2C1.2 I2C2.2 I2C3.2 89.7,10.88 | C9.1 82.56,33.99 C10.1 82.56,38.8 79.8,38.8 C11.1 79.2,42.56 C12.1 79.53,42.89 R24.1 81.4,42.89 81.4,48 | v25.1,54.2 38.2,54.2 38.2,54 42.96,54 GSM1.10 33.96,53.96 33.96,43.46 | v25.1,65 25.1,70 | U$5.3 89.1,58.68 89.1,57.5 84.2,57.5 | 84.2,57.5 81.4,57.5 | 81.4,57.5 81.4,57.4 80.3,57.4 | U$4.GND@4 101.71,82.67 U$4.GND@3 102.6,83.45 | 102.6,83.45 102.6,76.28 LED10.C 102.44,71.9 | V_IN1.2 102.44,68.63 102.44,71.9 | 89.8,71.9 79.9,71.9 79.9,60.76 | 89.8,71.9 102.44,71.9 | 89.8,76.1 89.8,71.9 | 50.9,31.6 50.9,30.3 43.3,30.3 | 50.8,30.26 50.8,31.6 50.9,31.6 | 81.4,48 89.3,48 89.3,47.1 91.1,47.1 IC1.4 | 82.6,33.99 82.6,27.2 | 82.6,27.2 90,27.2 90,27.44 F1.2 | 82.6,27.2 82.6,27.19 75.82,27.19 75.5,27.19 C7.- | 9.7,38.96 9.8,38.96
  Bottom 0.406: 9.8,38.96 R31-TEMP.2 | R21.1 43.06,12 43.4,12 43.4,6.95 | 43.4,6.95 SWD.3 | 43.3,30.3 33.5,30.3 33.5,5.6 43.4,5.6 43.4,6.95 | v59.1,17.2 61.52,17.2 | 61.52,17.2 UART_SIM.1 | 61.52,17.2 65.1,17.2 65.1,17.7 65.05,17.7 R11.2 | R17.1 41.2,88.7 41,88.7 | 41,88.7 v41,89.8 | v53.1,89.8 57.45,89.8 | 57.45,89.8 F2.1 | 57.45,89.8 57.45,86.36 U$3.6 62.1,86.16 62.1,88.8 69.4,88.8 T3.E | D5.A 43.1,74.7 | 43.1,74.7 43.1,71.81 | 43.1,71.81 C2.2 | 14.9,87.8 C16.- | 14.9,87.8 14.98,87.8 | 14.98,87.8 14.98,87.84 | R27.2 82.31,60.72 80.3,60.72 | C15.- 79.67,60.76 | 79.67,60.76 79.6,60.72 | 79.9,60.72 80.3,60.72 | 81.4,57.5 80.3,57.5 80.3,60.72 | GSM1.48 39.96,74.66 | 39.96,74.66 39.96,74.7 43.1,74.7 | 43.1,71.81 43.1,71.8 | 81.4,48 81.4,50.8 83.3,50.8 83.3,55 C17.- 84.5,55 84.2,55.1 84.2,57.5 | 79.9,60.72 79.9,60.76 | 79.9,60.76 79.67,60.76 | 89.8,76.39 89.8,76.1 | 89.8,76.1 C14.-
I2C_SCL  (via drill 0.6)
  Top 0.305: v60.6,39 v70,39
  Top 0.406: v71,35.6 v71,20.7
  Bottom 0.305: I2C1.3 92.35,23.5 80.6,23.5 80.6,14.8 71,14.8 v71,20.7 | STM32L152CBT6.42 62.99,39 v60.6,39
  Bottom 0.406: I2C3.3 I2C2.3 I2C1.3 | v70,39 70.1,39 70.1,35.6 v71,35.6
I2C_SDA  (via drill 0.6)
  Top 0.305: v62.3,40.7 v70.1,40.7 | v72.9,18.3 72.9,37.7 v72.5,37.7
  Bottom 0.305: 63.5,38.7 63.49,38.7 STM32L152CBT6.43 63.49,39.8 v62.3,40.7 | I2C1.4 94.89,24.2 79.6,24.2 79.6,16.3 72.9,16.3 v72.9,18.3
  Bottom 0.406: I2C1.4 I2C2.4 I2C3.4 | v70.1,40.7 71.2,40.7 71.2,37.7 v72.5,37.7
N$1  (via drill 0.6)
  Top 0.305: v86.8,51.2 v71.5,51.3
  Bottom 0.305: R10.2 65.01,19.45 R11.1 66.5,19.41 66.5,14.3 62.8,14.3 62.8,8.2 55.8,8.2 55.8,4.5 105.4,4.5 105.3,50.2 105.3,51.2
  Bottom 0.406: T3.B 71.3,83.8 71.2,83.8 71.2,51.3 v71.5,51.3 | v86.8,51.2 105.3,51.2 105.3,50.2
N$2
  Bottom 0.305: STM32L152CBT6.5 76.6,33.33 76.6,37.2 Q1.1
  Bottom 0.406: C10.2 80.84,37.08 Q1.1
N$3
  Bottom 0.406: R3.2 30.86,87.34 LED1.C
N$4
  Bottom 0.406: R1.2 28.61,77.41 T1.B 31.39,80.41 R2.2
N$5
  Bottom 0.406: R3.1 27.66,84.64 T1.C
N$6
  Bottom 0.406: U$4.RESETB 97.37,98 107.3,98 107.3,90.12 R33.1 107.75,88.72 R31.1
N$8
  Bottom 0.406: R7.2 37.91,77.46 T2.B 40.41,80.25 R6.2
N$9
  Bottom 0.406: R8.1 36.96,84.81 T2.C
N$10
  Bottom 0.305: 61.7,55.9 61.6,55.9 61.6,55.99 U$3.1
  Bottom 0.406: 42.96,55.4 47.5,55.4 47.5,53.23 D8.C 47.3,53.53 47.3,50 61.7,50 61.7,55.9 | 42.96,55.4 29,55.4 29,57.7 22.3,57.6 22.3,48.2 25.8,48.3 25.8,34.6 25.31,34.6 C3.2 | 42.96,55.4 GSM1.9
N$11
  Bottom 0.406: R8.2 38.66,86.51 LED2.C
N$12
  Bottom 0.406: 93.6,38.99 R23.1 | R25.2 93.6,38.99 | 93.6,38.99 93.6,44.6 IC1.2 84.55,44.6 R24.2
N$13  (via drill 0.6)
  Top 0.305: v79.3,46.8 v84.5,46.8
  Bottom 0.406: TR1.2 78.01,53.1 R22.1 79.3,52.98 v79.3,46.8 | IC1.3 84.5,45.88 v84.5,46.8
N$14
  Bottom 0.305: 50.5,53.53 D7.C
  Bottom 0.406: R12.1 51.9,57.7 51.9,53.54 50.87,53.54 D7.C | 50.5,53.53 50.5,51.6 59.7,51.6 59.7,58.2 64.6,58.2 64.6,55.95 U$3.2
N$15
  Bottom 0.406: R12.2 49.5,58.04 48.4,56.9 42.96,56.9 GSM1.8
N$16
  Bottom 0.305: 54.08,59.08 D6.C
  Bottom 0.406: U$3.3 67,59.5 54.08,59.5 | D6.C 54.08,59.5 | 54.08,59.5 54,59.3 54,64.58 R13.1
N$17
  Bottom 0.406: R13.2 48.9,64.58 48.9,60.08 47.5,58.5 42.96,58.5 GSM1.7
N$18  (via drill 0.6)
  Top 0.305: v61.5,72.6 61.4,72.5 v51.6,72.5
  Bottom 0.406: U$3.4 66.92,72.6 v61.5,72.6 | v51.6,72.5 51.6,74.7 52.5,74.7 | R14.1 50.94,74.72 52.5,74.72 | 52.5,74.72 D5.C | 52.5,74.72 52.5,74.7 | 52.5,74.7 52.6,74.7
N$19
  Bottom 0.305: C2.1 49.24,71.81
  Bottom 0.406: GSM1.6 47.3,59.96 47.3,67.5 49.24,67.5 R14.2 49.24,71.81
N$20
  Bottom 0.406: GSM1.27 23.4,38.96 23.4,42.5 7.9,42.5 R31-TEMP.1
N$21
  Bottom 0.406: U$4.PIO(1) 97.39,82.67 R32.1
N$22
  Bottom 0.406: T4.B 49.7,83.47 49.7,82.8 R16.1 49.75,78.93 46.07,78.92 46.07,79.9 R15.2
N$23
  Bottom 0.406: U$2.ATN 12.48,76.32 13,75.8 13,72 GSM1.33
N$24
  Bottom 0.406: LED3.A 48.49,88.49 T4.C
N$25
  Bottom 0.406: LED3.C 45.14,84.76 R17.2
N$28
  Bottom 0.305: STM32L152CBT6.6 67.64,32.8 77.94,32.8 Q1.2
  Bottom 0.406: Q1.2 80.86,32.27 C9.2
N$29
  Bottom 0.305: STM32L152CBT6.4 75.14,33.83 75.14,40.03 | 75.14,40.03 Q2.2 | C11.2 75.14,40.03
N$30
  Bottom 0.305: 77.34,45.34 Q2.1 75.14,45.4 73.9,45.4 73.9,34.33 STM32L152CBT6.3
  Bottom 0.406: 77.34,45.34 78.4,44.5 C12.2
N$31
  Bottom 0.305: STM32L152CBT6.9 70.7,31.33 70.7,29.5 73.77,29.5 C8.2 72.87,22 75.3,22 75.3,20.5 78.7,20.5 78.7,25.4 L2-FCM1608-0603.1
  Bottom 0.406: 75.3,21.5 75.3,22 C7.+
N$32
  Bottom 0.305: STM32L152CBT6.44 63.99,41.4 62,43.2 61.5,43.7 60.1,43.7 60.1,46.18 R4.2
  Bottom 0.406: R4.2 60.12,45.92 R9.2
N$33
  Bottom 0.406: R32.2 99.3,76.9 98.94,76.9 LED10.A
N$34
  Bottom 0.406: R9.1 57.2,40.17 R20.1
N$35
  Bottom 0.305: STM32L152CBT6.20 62.5,20.7 47.1,20.7 47.1,24.2 39.4,24.2 39.4,21.14 | STM32L152CBT6.20 | STM32L152CBT6.20 62.5,28.2
  Bottom 0.406: R19.1 39.4,21.14 37.75,21.14 R18.1
N$36
  Bottom 0.406: R19.2 42.22,21.14 42.7,21.1 43.09,21.21 R21.2
N$38
  Bottom 0.406: U$5.5 93.22,64.94 88.05,64.93 88.06,68.64 R26.2 R27.1
NL
  Bottom 0.406: R1.1 29.5,75.71 29.5,71.96 | GSM1.41 29.5,71.96 | 29.5,71.96 29.5,71.5
NRST  (via drill 0.6)
  Top 0.305: v76.7,28.4 v85.7,28.4 | v51.7,5.7 v58.1,5.7 | v101.1,31.9 96.2,31.9 v96.2,32
  Bottom 0.305: STM32L152CBT6.7 67.64,32.3 76.7,32.3 v76.7,28.4 | v85.7,28.4 85.7,31.7 | 85.7,31.7 C21.1 | 85.7,31.7 90.54,31.7 90.54,32 | 90.54,32 F1.1 | SWD.5 48.46,8.3 | v58.1,5.7 101.1,5.7 v101.1,31.9 | 90.54,32 v96.2,32 96.2,29 R5.1
  Bottom 0.406: 48.46,8.3 51.7,8.3 v51.7,5.7
POWER
  Bottom 0.305: STM32L152CBT6.14 65.5,24.98 R10.1
PWRK
  Bottom 0.305: T3.C 70.35,92.56 F2.2 64.85,92.6 74,92.6 74,65.7 73.1,65.7 73.1,49.3 | 42.96,50.9 GSM1.12
  Bottom 0.406: 42.96,50.9 44.9,50.9 44.9,47.5 54.8,47.5 55.4,47.9 72.1,47.9 73.1,49.3
RING
  Bottom 0.406: GSM1.11 45.9,52.46 45.9,48.8 63.7,48.8 63.7,53.1 69.2,53.1 69.2,63.4 57.3,63.4 57.3,77.7 49.1,77.7 49.2,77.65 44.65,77.65 44.1,78.2 44.1,78.18 R15.1
STAT
  Bottom 0.406: R6.1 40.77,76.3 46.5,76.3 46.6,69.5 45.8,69.5 45.8,61.46 GSM1.5
SWCLK  (via drill 0.6)
  Top 0.305: v55.6,19.1 55.8,19.1 v55.8,37.3
  Bottom 0.305: v55.8,37.3 60.49,37.3 STM32L152CBT6.37
  Bottom 0.406: v55.6,19.1 46.8,19.1 46.8,16.6 40.8,16.5 40.8,6.95 SWD.2
SWDAT  (via drill 0.6)
  Top 0.406: v46.2,27.2 v46.2,13.9
  Bottom 0.305: STM32L152CBT6.34 57.3,34.33 57.3,28.2 57.4,28.1
  Bottom 0.406: 57.4,28.1 46.2,28.1 v46.2,27.2 | v46.2,13.9 45.82,13.9 SWD.4
USART2_RX  (via drill 0.6)  (1 unrouted)
  Top 0.305: v64.2,2 v64.2,7.5
  Bottom 0.305: UART_SIM.2 64.1,12.1 64.1,13.1 67.7,13.1 67.7,26.7 65.99,26.7 STM32L152CBT6.13 | v64.2,7.5 64.2,10.6 64.1,10.6
  Bottom 0.406: U$4.UART-RX 83.87,102.6 3.2,102.6 3.2,59.4 | 3.2,59.4 3.1,59.4 3.1,2 v64.2,2 | 3.2,59.4 37.5,59.4 37.5,62.8 42.9,62.8 42.9,62.96 GSM1.4
USART2_TX  (via drill 0.6)
  Top 0.305: 66.9,1.1 v66.9,1.2 v66.9,7.7 | v5.5,60.7 1.2,60.7 v1.4,60.6
  Bottom 0.305: STM32L152CBT6.12 69.5,29.83 69.5,10.6 UART_SIM.3 66.6,7.7 v66.9,7.7 | 1.5,0.8 2,0.8 | 66.9,1.1 v66.9,1.2 | 6.5,60.6 5.2,60.6 v5.5,60.7
  Bottom 0.406: U$4.UART-TX 82.37,101.5 5.1,101.5 5.1,60.6 6.5,60.6 36.2,60.6 36.2,64.4 42.96,64.4 GSM1.3 | v1.4,60.6 1.4,0.8 2,0.8 66.9,0.8 66.9,1.1
USB+
  Bottom 0.406: GSM1.28 21.9,31.96 18.4,31.9 18.36,16.8 16.2,16.8 15.96,16.52 X1.1
V_IN  (via drill 0.6)
  Top 0.305: v86.3,99.9 v78,99.9 | 20.1,93.5 v20.1,93.4 v20.1,89.6
  Bottom 0.305: 22.4,93.5 v20.1,93.4 | v20.1,89.6 20.24,89.5 S1.3
  Bottom 0.406: 93.2,55.3 93.22,54.58 | 93.22,54.58 93.22,52.6 109.6,52.6 109.6,52.5 109.7,52.5 109.7,3.4 26.54,3.4 V_IN.1 26.44,10.7 28.8,10.7 28.8,21.15 R29.1 | 93.22,54.58 U$5.1 | U$5.1 U$5.2 95.1,56.98 95.1,65.5 111.4,65.5 111.4,99.9 v86.3,99.9 | v78,99.9 45.7,99.9 45.7,92.6 26.2,92.6 26.2,93.5 22.4,93.5 20.3,93.5 v20.1,93.4 | C17.+ 88.8,55.28 U$5.1
VBAT@2
  Bottom 0.406: S1.1 S1.2 21.96,78.29 GSM1.38 GSM1.39
VRTC(BACKUP)
  Bottom 0.406: GSM1.15 45.5,46.46 45.5,34.37 C1.+
(copper drawn outside any net)
  shapes: Bottom area x1